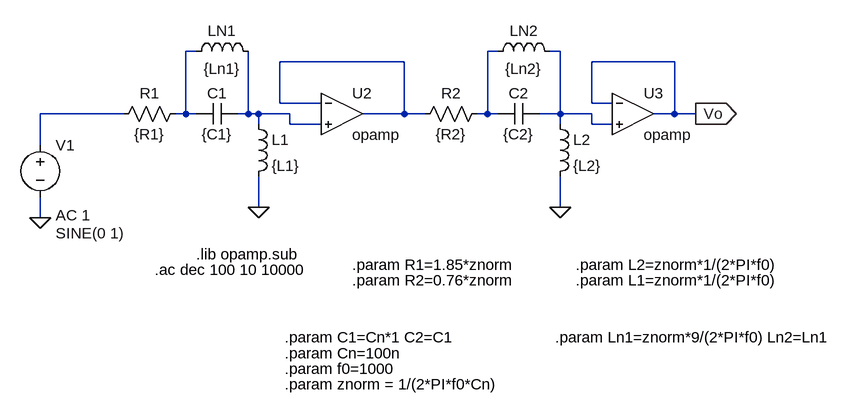
[diagram p0: schematic TS6_1.asc]
TS6_1.asc, the LTspice schematic file:
Version 4
SHEET 1 1364 680
WIRE -320 -96 -336 -96
WIRE 144 -96 128 -96
WIRE 240 -96 224 -96
WIRE 0 -80 -192 -80
WIRE 416 -80 288 -80
WIRE -192 -16 -192 -80
WIRE -128 -16 -192 -16
WIRE 288 -16 288 -80
WIRE 320 -16 288 -16
WIRE -432 0 -560 0
WIRE -336 0 -336 -96
WIRE -336 0 -352 0
WIRE -320 0 -336 0
WIRE -240 0 -240 -96
WIRE -240 0 -256 0
WIRE -224 0 -240 0
WIRE -176 0 -224 0
WIRE 0 0 0 -80
WIRE 0 0 -64 0
WIRE 32 0 0 0
WIRE 128 0 128 -96
WIRE 128 0 112 0
WIRE 144 0 128 0
WIRE 240 0 240 -96
WIRE 240 0 208 0
WIRE 288 0 240 0
WIRE 416 0 416 -80
WIRE 416 0 384 0
WIRE 448 0 416 0
WIRE -224 16 -224 0
WIRE -176 16 -176 0
WIRE -128 16 -176 16
WIRE 240 16 240 0
WIRE 288 16 288 0
WIRE 320 16 288 16
WIRE -560 48 -560 0
WIRE -224 144 -224 96
WIRE 240 144 240 96
WIRE -560 160 -560 128
FLAG -560 160 0
FLAG -224 144 0
FLAG 448 0 Vo
IOPIN 448 0 Out
FLAG 240 144 0
SYMBOL voltage -560 32 R0
WINDOW 123 24 124 Left 2
WINDOW 39 0 0 Left 0
WINDOW 3 24 152 Left 2
SYMATTR Value2 AC 1
SYMATTR Value SINE(0 1)
SYMATTR InstName V1
SYMBOL res -336 -16 R90
WINDOW 0 0 56 VBottom 2
WINDOW 3 32 56 VTop 2
SYMATTR InstName R1
SYMATTR Value {R1}
SYMBOL ind -240 0 R0
SYMATTR InstName L1
SYMATTR Value {L1}
SYMBOL cap -256 -16 R90
WINDOW 0 0 32 VBottom 2
WINDOW 3 32 32 VTop 2
SYMATTR InstName C1
SYMATTR Value {C1}
SYMBOL OpAmps\\opamp -96 -64 R0
SYMATTR InstName U2
SYMBOL OpAmps\\opamp 352 -64 R0
SYMATTR InstName U3
SYMBOL res 128 -16 R90
WINDOW 0 0 56 VBottom 2
WINDOW 3 32 56 VTop 2
SYMATTR InstName R2
SYMATTR Value {R2}
SYMBOL ind 224 0 R0
SYMATTR InstName L2
SYMATTR Value {L2}
SYMBOL cap 208 -16 R90
WINDOW 0 0 32 VBottom 2
WINDOW 3 32 32 VTop 2
SYMATTR InstName C2
SYMATTR Value {C2}
SYMBOL ind -336 -80 R270
WINDOW 0 32 56 VTop 2
WINDOW 3 5 56 VBottom 2
SYMATTR InstName LN1
SYMATTR Value {Ln1}
SYMBOL ind 128 -80 R270
WINDOW 0 32 56 VTop 2
WINDOW 3 5 56 VBottom 2
SYMATTR InstName LN2
SYMATTR Value {Ln2}
TEXT -320 216 Left 2 !.lib opamp.sub
TEXT -384 240 Left 2 !.ac dec 100 10 10000
TEXT -80 232 Left 2 !.param R1=1.85*znorm
TEXT -80 256 Left 2 !.param R2=0.76*znorm
TEXT 264 232 Left 2 !.param L2=znorm*1/(2*PI*f0)
TEXT 264 256 Left 2 !.param L1=znorm*1/(2*PI*f0)
TEXT -184 344 Left 2 !.param C1=Cn*1 C2=C1
TEXT -184 368 Left 2 !.param Cn=100n
TEXT 232 344 Left 2 !.param Ln1=znorm*9/(2*PI*f0) Ln2=Ln1
TEXT -184 392 Left 2 !.param f0=1000
TEXT -184 416 Left 2 !.param znorm = 1/(2*PI*f0*Cn)

The netlist it stands for:
* TS6_1.asc
V1 N005 0 SINE(0 1) AC 1
R1 N001 N005 {R1}
L1 N006 0 {L1}
C1 N006 N001 {C1}
XU2 N004 N006 N004 opamp Aol=100K GBW=10Meg  ; pins invin noninvin out
XU3 Vo N003 Vo opamp Aol=100K GBW=10Meg  ; pins invin noninvin out
R2 N002 N004 {R2}
L2 N003 0 {L2}
C2 N003 N002 {C2}
LN1 N001 N006 {Ln1}
LN2 N002 N003 {Ln2}
.lib opamp.sub
.ac dec 100 10 10000
.param R1=1.85*znorm
.param R2=0.76*znorm
.param L2=znorm*1/(2*PI*f0)
.param L1=znorm*1/(2*PI*f0)
.param C1=Cn*1 C2=C1
.param Cn=100n
.param Ln1=znorm*9/(2*PI*f0) Ln2=Ln1
.param f0=1000
.param znorm = 1/(2*PI*f0*Cn)
.backanno
.end